# EAGLE design Full Water Level Detector Project Schematic (EAGLE 7.4.0)
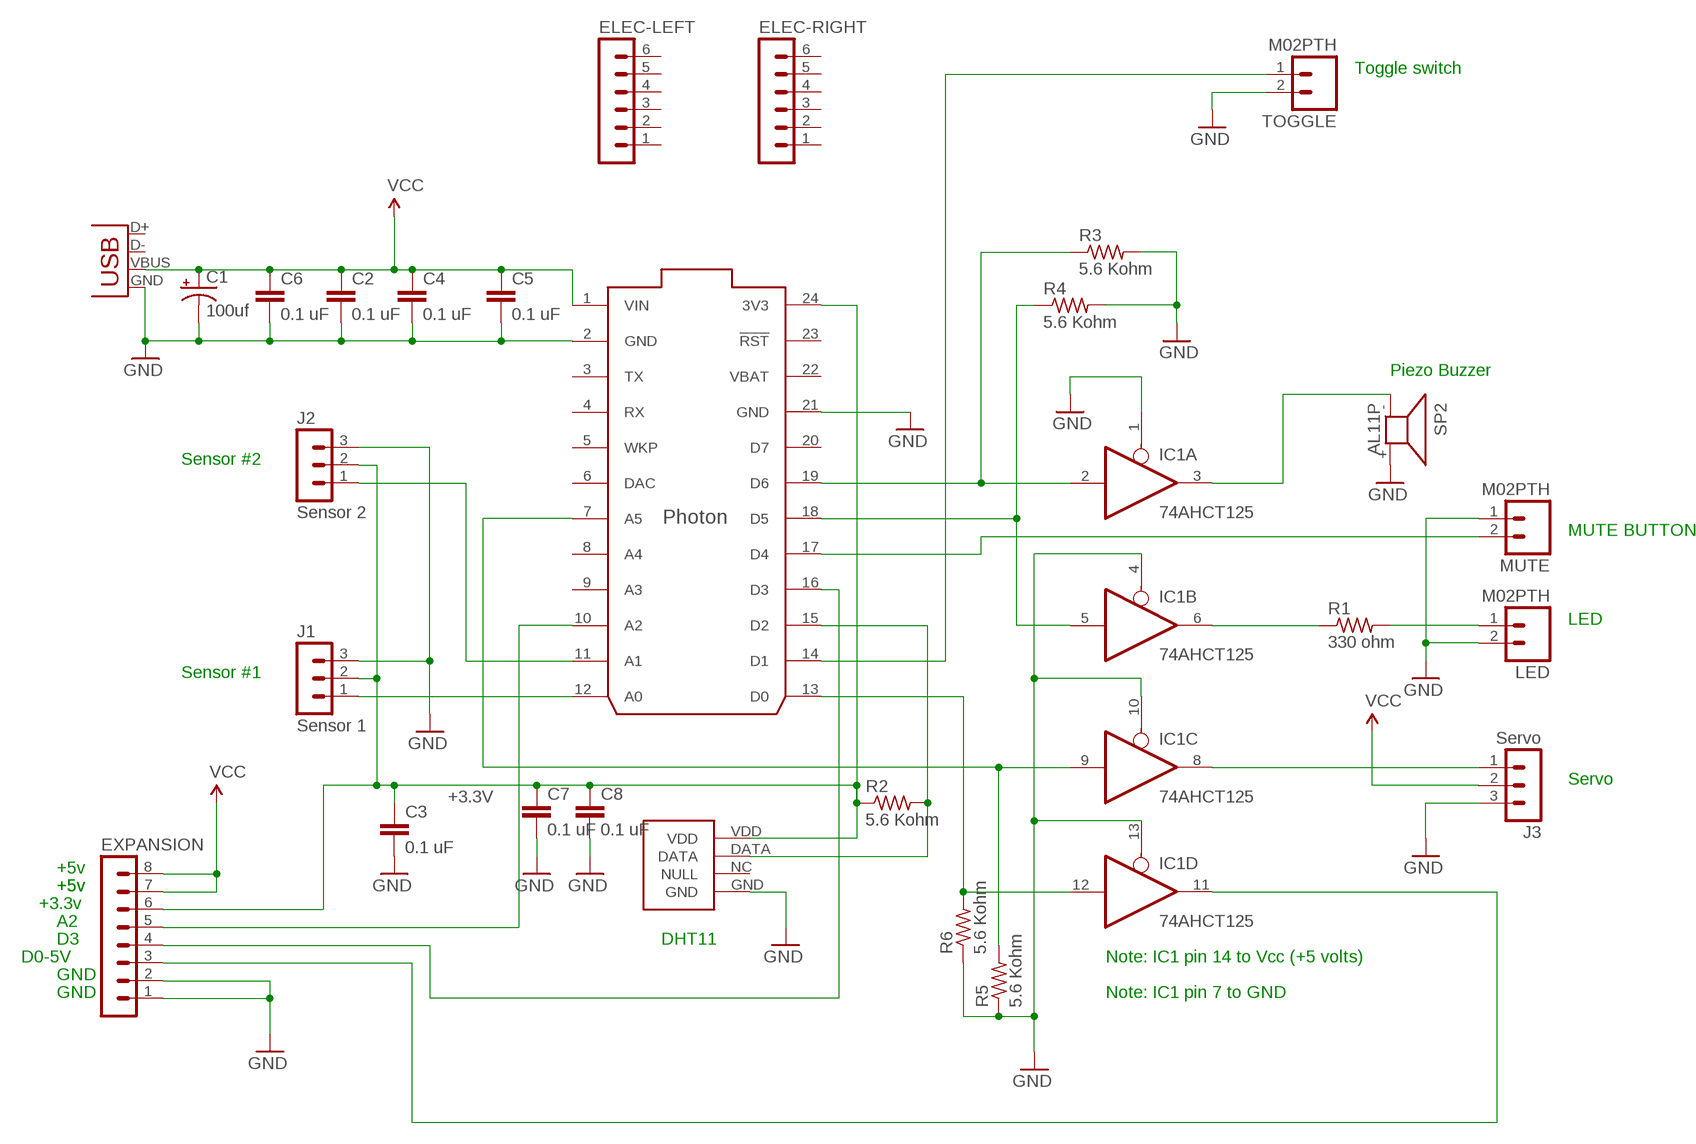
[diagram p0: schematic, sheet 1]

## Parts
C1  100uf  CAP_POLPTH1  [CPOL-RADIAL-100UF-25V]
C2  0.1 uF  CAPPTH  [CAP-PTH-SMALL]
C3  0.1 uF  CAPPTH  [CAP-PTH-SMALL]
C4  0.1 uF  CAPPTH  [CAP-PTH-SMALL]
C5  0.1 uF  CAPPTH  [CAP-PTH-SMALL]
C6  0.1 uF  CAPPTH  [CAP-PTH-SMALL]
C7  0.1 uF  CAPPTH  [CAP-PTH-SMALL]
C8  0.1 uF  CAPPTH  [CAP-PTH-SMALL]
ELEC-LEFT  MA06-1  [MA06-1]
ELEC-RIGHT  MA06-1  [MA06-1]
EXPANSION  MA08-1  [MA08-1]
IC1  74AHCT125  74125N  [DIL14]
J1  Sensor 1  MA03-1  [MA03-1]
J2  Sensor 2  MA03-1  [MA03-1]
J3  Servo  MA03-1  [MA03-1]
JP1  USB-B  USBPTH  [USB-B-PTH]
LED  M02PTH  [1X02]
MUTE  M02PTH  [1X02]
R1  330 ohm  R-US_0309/12  [0309/12]
R2  5.6 Kohm  R-US_0309/12  [0309/12]
R3  5.6 Kohm  R-US_0309/12  [0309/12]
R4  5.6 Kohm  R-US_0309/12  [0309/12]
R5  5.6 Kohm  R-US_0309/12  [0309/12]
R6  5.6 Kohm  R-US_0309/12  [0309/12]
SP2  AL11P  [AL11P]
TOGGLE  M02PTH  [1X02]
U$1  PHOTON_SMD  [PHOTON_SMD]
U$2  DHT22  [DHT22]

## Nets
+3.3V: C3.1 C7.1 C8.1 EXPANSION.6 J1.2 J2.2 R2.1 U$1.24(3V3) U$2.VDD
GND: C1.2(-) C2.2 C3.2 C4.2 C5.2 C6.2 C7.2 C8.2 EXPANSION.1 EXPANSION.2 IC1.1(A:OE) IC1.4(B:OE) IC1.10(C:OE) IC1.13(D:OE) J1.3 J2.3 J3.3 JP1.GND LED.2 MUTE.1 R3.2 R4.2 R5.1 R6.1 SP2.+ TOGGLE.2 U$1.2(GND) U$1.21(GND) U$2.GND
N$1: IC1.8(C:O) J3.1
N$2: J2.1 U$1.11(A1)
N$3: J1.1 U$1.12(A0)
N$4: IC1.2(A:I) R3.1 U$1.19(D6)
N$6: IC1.3(A:O) SP2.-
N$7: IC1.9(C:I) R5.2 U$1.7(A5)
N$9: IC1.6(B:O) R1.1
N$10: LED.1 R1.2
N$11: MUTE.2 U$1.17(D4)
N$14: EXPANSION.4 U$1.16(D3)
N$15: EXPANSION.3 IC1.11(D:O)
N$16: EXPANSION.5 U$1.10(A2)
N$17: IC1.12(D:I) R6.2 U$1.13(D0)
N$19: R2.2 U$1.15(D2) U$2.DATA
N$22: TOGGLE.1 U$1.14(D1)
N$23: IC1.5(B:I) R4.1 U$1.18(D5)
VCC: C1.1(+) C2.1 C4.1 C5.1 C6.1 EXPANSION.7 EXPANSION.8 J3.2 JP1.VBUS U$1.1(VIN)
Unconnected: ELEC-LEFT.1 ELEC-LEFT.2 ELEC-LEFT.3 ELEC-LEFT.4 ELEC-LEFT.5 ELEC-LEFT.6 ELEC-RIGHT.1 ELEC-RIGHT.2 ELEC-RIGHT.3 ELEC-RIGHT.4 ELEC-RIGHT.5 ELEC-RIGHT.6 JP1.D+ JP1.D- U$1.3(TX) U$1.4(RX) U$1.5(WKP) U$1.6(DAC) U$1.8(A4) U$1.9(A3) U$1.20(D7) U$1.23(!RST) U$1.25(EN) U$1.26(!SETUP) U$1.27(RGB_RED) U$1.28(RGB_GREEN) U$1.29(RGB_BLUE) U$1.30(USB_D-) U$1.31(USB_D+) U$2.NC(NULL)

## Notes on the sheet
- Toggle switch
- Piezo Buzzer
- Sensor #2
- MUTE BUTTON
- LED
- Sensor #1
- Servo
- +5v
- +5v | +5v
- +3.3v
- A2
- D3 | DHT11
- D0-5V | Note: IC1 pin 14 to Vcc (+5 volts)
- GND
- GND | Note: IC1 pin 7 to GND

## Power pins joined to a net without a drawn wire
GND: IC1.7(P:GND)
VBAT: U$1.22(VBAT)
VCC: IC1.14(P:VCC)

## Library data of the parts
C1 = SparkFun-Capacitors:CAP_POL: Capacitor Polarized These are standard SMD and PTH capacitors. Normally 10uF, 47uF, and 100uF in electrolytic and tantalum varieties. Always verify the external diameter of the through hole cap, it varies with capacity, voltage, and manufacturer. The EIA devices should be standard.
C2-C8 = SparkFun-Passives:CAP: Capacitor Standard 0603 ceramic capacitor, and 0.1" leaded capacitor.
ELEC-LEFT ELEC-RIGHT = con-lstb:MA06-1: PIN HEADER; OC_FARNELL: unknown; OC_NEWARK: unknown
EXPANSION = con-lstb:MA08-1: PIN HEADER; OC_FARNELL: unknown; OC_NEWARK: unknown
IC1 = 74xx-us:74*125: Quad bus BUFFER, 3-state
J1-J3 = con-lstb:MA03-1: PIN HEADER; OC_FARNELL: unknown; OC_NEWARK: unknown
JP1 = SparkFun-Connectors:USB: USB Connectors USB-B-PTH is fully proven SKU : PRT-00139/CONN-08278 USB-miniB is fully proven SKU : PRT-00587 USB-A-PCB is untested. USB-A-H is throughly reviewed, but untested. Spark Fun Electronics SKU : PRT-00437 USB-B-SMT is throughly reviewed, but untested. Needs silkscreen touching up. USB-A-S has not been used/tested USB-MB-H has not been used/tested USB-MICROB has been used. CONN-09505; PROD_ID: CONN-08278
LED MUTE TOGGLE = SparkFun-Connectors:M02: Standard 2-pin 0.1" header. Use with - straight break away headers ( PRT-00116) - right angle break away headers (PRT-00553) - swiss pins (PRT-00743) - machine pins (PRT-00117) - female headers (PRT-00115) Molex polarized connector foot print use with: PRT-08233 with associated crimp pins and housings. 2.54_SCREWTERM for use with PRT-10571. 3.5mm Screw Terminal footprints for PRT-08084 5mm Screw Terminal footprints for use with PRT-08433
R1-R6 = rcl:R-US_: RESISTOR, American symbol
SP2 = buzzer:AL11P: SPEAKER Source: Buerklin; OC_FARNELL: unknown; OC_NEWARK: unknown
U$1 = Spark:PHOTON_SMD: Photon (without headers) - designed to be surface mounted with 7 extra exposed pads on the bottom of the board which include, 3 RGB LED outputs, /SETUP, EN (3.3V SMPS enable input), USB D+ and USB D-.
U$2 = Spark:DHT22

## Board
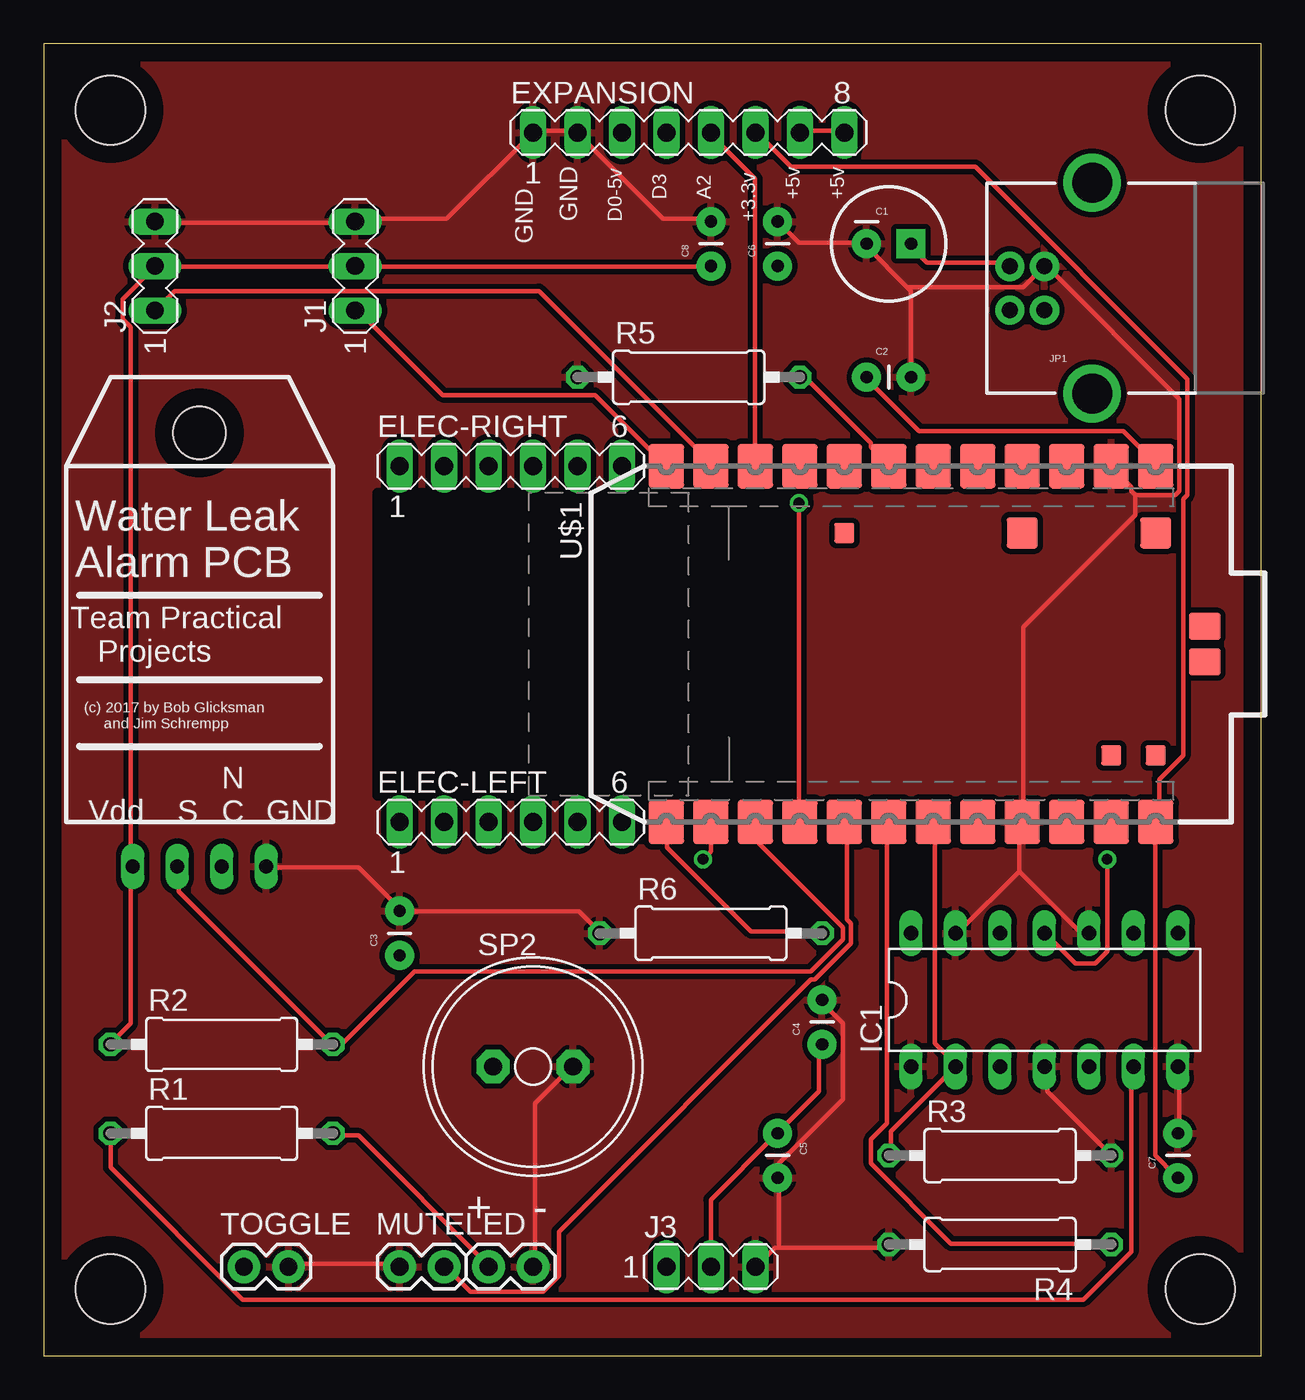
[diagram p1: board, top side]
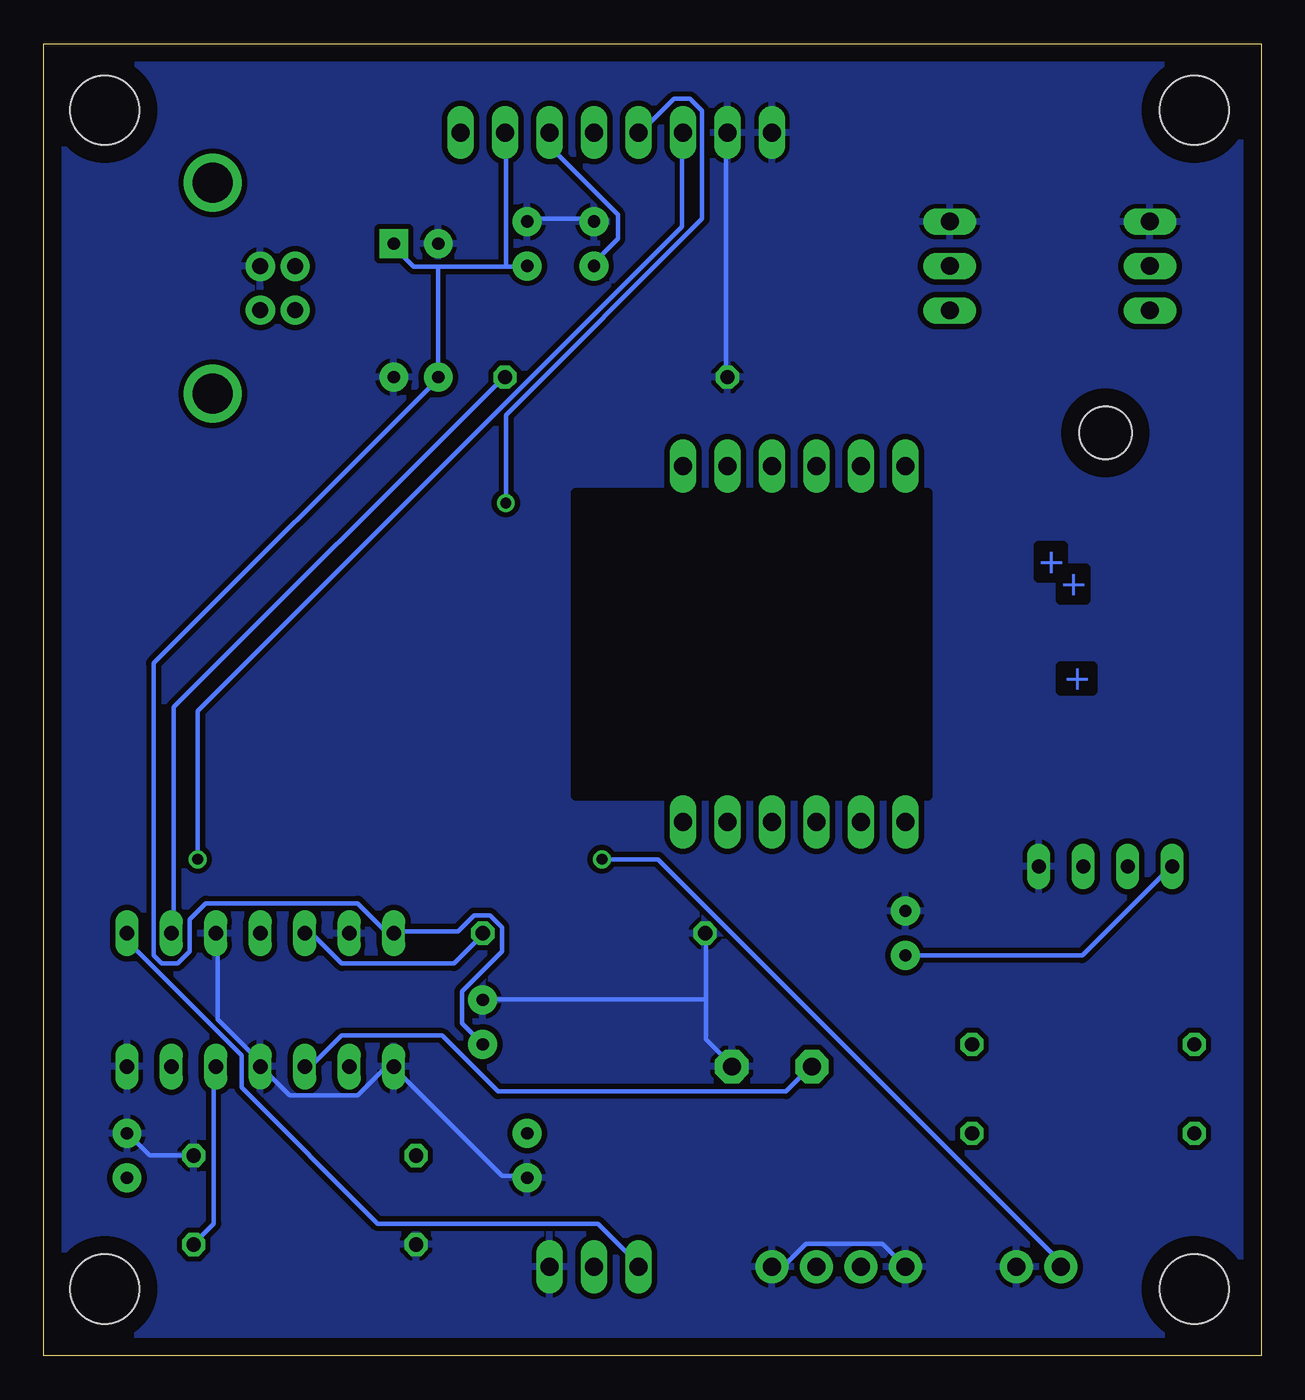
[diagram p2: board, bottom side, seen from below]

Size 69.52 x 74.92 mm. Coordinates in mm from the lower left corner, seen from the top.
Outline: 0,0 69.52,0 69.52,74.92 0,74.92 0,0
Copper layers (1*16): Top 0.035mm / dielectric 1.5mm / Bottom 0.035mm
Design rules "default": minimum track width 10mil, minimum drill 24mil, track to track 8mil, track to pad 8mil, pad to pad 8mil, via to via 8mil, smd to smd 8mil, copper to edge 40mil, drill to drill 8mil, minimum pad ring 10mil, minimum via ring 8mil, stop-mask expansion 4mil, vias tented up to drill 0mil, thermal gap 10mil
Holes 3.96 mm at 66.04,71.12 3.81,3.81 66.04,3.81 3.81,71.12
tKeepout: area 19.1,32.3 to 39.1,49.3
bKeepout: area 19.1,32 to 39.1,49.3
tRestrict: area 19.1,32 to 39.1,49.3
bRestrict: area 19.1,32 to 39.1,49.3

### Footprints (pad centres in the part's own frame; a part is rotated, then mirrored left to right if it is on the bottom)
CPOL-RADIAL-100UF-25V = drill 0.7 pad 1.651 square: 1 1.27,0 | drill 0.7 pad 1.651: 2 -1.27,0
CAP-PTH-SMALL = drill 0.7 pad 1.651: 1 0,0; 2 2.54,0
MA06-1 = drill 1.016 long: 1 -6.35,0; 2 -3.81,0; 3 -1.27,0; 4 1.27,0; 5 3.81,0; 6 6.35,0
MA08-1 = drill 1.016 long: 1 -8.89,0; 2 -6.35,0; 3 -3.81,0; 4 -1.27,0; 5 1.27,0; 6 3.81,0; 7 6.35,0; 8 8.89,0
DIL14 = drill 0.813 long: 1 -7.62,-3.81; 2 -5.08,-3.81; 3 -2.54,-3.81; 4 0,-3.81; 5 2.54,-3.81; 6 5.08,-3.81; 7 7.62,-3.81; 8 7.62,3.81; 9 5.08,3.81; 10 2.54,3.81; 11 0,3.81; 12 -2.54,3.81; 13 -5.08,3.81; 14 -7.62,3.81
MA03-1 = drill 1.016 long: 1 -2.54,0; 2 0,0; 3 2.54,0
USB-B-PTH = drill 0.914 pad 1.676: D+ 0,1.25; D- 1.981,1.25; GND 0,-1.25; VBUS 1.981,-1.25 | drill 2.286: S1 -2.718,-6.02; S2 -2.718,6.02
1X02 = drill 1.016 pad 1.88: 1 0,0; 2 2.54,0
0309/12 = drill 0.813 octagon: 1 -6.35,0; 2 6.35,0
AL11P = drill 1.016 pad 1.905 octagon: + 2.286,0; - -2.286,0
PHOTON_SMD = smd 2.54 x 2.032: 1 0,32.258; 2 0,29.718; 3 0,27.178; 4 0,24.638; 5 0,22.098; 6 0,19.558; 7 0,17.018; 8 0,14.478; 9 0,11.938; 10 0,9.398; 11 0,6.858; 12 0,4.318; 13 20.32,4.318; 14 20.32,6.858; 15 20.32,9.398; 16 20.32,11.938; 17 20.32,14.478; 18 20.32,17.018; 19 20.32,19.558; 20 20.32,22.098; 21 20.32,24.638; 22 20.32,27.178; 23 20.32,29.718; 24 20.32,32.258 | smd 1.778 x 1.778: 25 3.81,32.258; 26 3.81,24.638 | smd 1.143 x 1.143: 27 3.81,14.478; 28 16.51,29.718; 29 16.51,32.258 | smd 1.524 x 1.778: 30 11.176,35.052; 31 9.144,35.052
DHT22 = drill 0.8 long: DATA -1.27,0; GND 3.81,0; NC 1.27,0; VDD -3.81,0 | hole 3: 0,24.765

### Placement (x,y rotation side)
C1  48.26,63.5 0 top
C2  46.99,55.88 0 top
C3  20.32,22.86 90 top
C4  44.45,17.78 90 top
C5  41.91,12.7 270 top
C6  41.91,62.23 90 top
C7  64.77,10.16 90 top
C8  38.1,62.23 90 top
ELEC-LEFT  26.67,30.48 0 top
ELEC-RIGHT  26.67,50.8 0 top
EXPANSION  36.83,69.85 0 top
IC1  57.15,20.32 0 top
J1  17.78,62.23 90 top
J2  6.35,62.23 90 top
J3  38.1,5.08 0 top
JP1  57.15,60.96 180 top
LED  25.4,5.08 0 top
MUTE  20.32,5.08 0 top
R1  10.16,12.7 0 top
R2  10.16,17.78 0 top
R3  54.61,11.43 0 top
R4  54.61,6.35 180 top
R5  36.83,55.88 0 top
R6  38.1,24.13 0 top
SP2  27.94,16.51 0 top
TOGGLE  11.43,5.08 0 top
U$1  31.24,50.8 270 top
U$2  8.89,27.94 0 top

### Tracks (layer width: path | path; a pad name or v marks a point on that pad's centre or on a via)
+3.3V
  Top 0.254: R2.1 3.81,17.83 4.95,18.97 4.95,27.89 U$2.VDD 4.95,28.12 4.95,58.75 4.5,59.21 4.5,60.35 6.32,62.18 J2.2 6.55,62.18 17.75,62.18 J1.2 17.98,62.18 38.1,62.18 C8.1 | C7.1 64.62,10.29 63.47,11.43 63.47,30.4 U$1.24 63.7,30.63 63.7,32.92 65.08,34.29 65.08,48.92 65.3,49.15 65.3,55.78 53.19,67.89 42.67,67.89 40.84,69.72 EXPANSION.6
  Bottom 0.254: C3.1 10.21,22.86 5.18,27.89 U$2.VDD | EXPANSION.6 40.61,69.72 40.61,69.04 36.73,65.15 36.73,63.78 38.1,62.41 C8.1
GND
  Top 0.254: J2.3 6.55,64.69 17.75,64.69 J1.3 17.98,64.92 23.01,64.92 EXPANSION.1 28.04,69.95 30.33,69.95 EXPANSION.2 30.56,69.72 35.36,64.92 38.1,64.92 C8.2 | 62.33,49.15 62.1,49.38 62.1,49.61 60.96,50.75 U$1.2 | 62.33,49.15 64.62,49.15 64.85,49.38 64.85,54.63 57.3,62.18 JP1.GND 57.07,62.18 55.93,61.04 49.3,61.04 | C6.2 43.13,63.55 46.79,63.55 C1.2 47.02,63.32 49.3,61.04 | C2.2 49.53,60.81 49.3,61.04 | 55.7,27.66 55.7,30.4 U$1.21 55.93,30.63 55.93,41.6 62.33,48.01 62.33,49.15 | 55.7,27.66 52.27,24.23 IC1.13 | 55.7,27.66 59.13,24.23 59.59,24.23 IC1.10 | 41.99,6.17 41.76,6.17 40.84,5.26 J3.3 | 41.99,6.17 48.16,6.17 R4.2 | 41.99,6.17 41.99,10.06 C5.2 41.99,10.29 41.99,10.97 45.64,14.63 45.64,18.97 44.5,20.12 C4.2 | IC1.7 64.85,16.46 64.85,12.8 C7.2 | R3.2 57.3,15.09 57.3,16.46 IC1.4 | TOGGLE.2 14.1,5.26 20.27,5.26 MUTE.1 | U$2.GND 12.72,27.89 17.98,27.89 20.27,25.6 C3.2 20.5,25.38 30.56,25.38 31.7,24.23 R6.1 | LED.2 28.04,5.26 28.04,14.4 30.1,16.46 SP2.+
  Bottom 0.254: R5.1 30.56,56.01 30.56,69.72 EXPANSION.2 | C8.2 38.1,64.92 41.76,64.92 C6.2 | 49.53,16.46 49.99,16.46 51.59,14.86 55.47,14.86 57.07,16.46 IC1.4 57.07,16.69 59.59,19.2 59.59,24 IC1.10 | R3.2 63.47,11.43 64.62,12.57 C7.2 | 49.53,16.46 43.36,10.29 41.99,10.29 C5.2 | 49.53,16.46 IC1.1 | MUTE.1 21.64,6.4 25.98,6.4 27.13,5.26 27.81,5.26 LED.2 | 31.7,20.34 31.7,18.06 30.33,16.69 SP2.+ | 31.7,20.34 31.7,24 R6.1 | 31.7,20.34 44.27,20.34 C4.2
  pour Top (isolate 0.305): 0,74.93 69.85,74.93 69.85,0 0,0
  pour Bottom (isolate 0.305): 0,74.93 69.85,74.93 69.85,0 0,0
N$1
  Bottom 0.254: IC1.8 64.62,24 64.62,23.55 58.22,17.14 58.22,15.32 50.44,7.54 37.87,7.54 35.58,5.26 J3.1
N$2
  Top 0.254: J2.1 7.47,60.81 28.27,60.81 38.1,50.98 U$1.11
N$3
  Top 0.254: U$1.12 35.36,50.98 31.47,54.86 22.78,54.86 17.98,59.66 J1.1
N$4
  Top 0.254: U$1.19 50.9,30.4 50.9,17.83 52.05,16.69 IC1.2 52.05,16.46 48.39,12.8 48.39,11.43 R3.1
N$6
  Bottom 0.254: IC1.3 54.56,16.69 54.1,16.69 52.5,18.29 46.79,18.29 43.59,15.09 27.13,15.09 25.76,16.46 SP2.-
N$7
  Top 0.254: U$1.7 48.16,50.98 47.24,51.89 47.24,52.12 43.36,56.01 R5.2
  Bottom 0.254: IC1.9 62.1,24.23 62.1,37.03 43.36,55.78 R5.2
N$9
  Top 0.254: R1.1 3.81,10.74 11.35,3.2 59.36,3.2 62.1,5.94 62.1,16.46 IC1.6
N$10
  Top 0.254: R1.2 16.61,12.57 17.98,12.57 25.3,5.26 LED.1
N$11
  Top 0.254: U$1.17 45.87,30.4 45.87,24.92 46.1,24.69 46.1,23.55 44.04,21.49 43.81,21.49 29.41,7.09 29.41,4.57 28.5,3.66 24.38,3.66 23.01,5.03 MUTE.2
N$14  (via drill 0.61)
  Top 0.254: v43.13,48.69 43.13,30.63 U$1.16
  Bottom 0.254: v43.13,48.69 43.13,53.72 31.93,64.92 31.93,71.09 32.61,71.78 33.53,71.78 35.36,69.95 EXPANSION.4
N$15  (via drill 0.61)
  Top 0.254: v60.73,28.35 60.73,23.09 60.05,22.4 58.9,22.4 57.3,24 IC1.11
  Bottom 0.254: v60.73,28.35 60.73,36.8 33.07,64.47 33.07,69.72 EXPANSION.3
N$16
  Top 0.254: U$1.10 40.61,50.98 40.61,67.21 38.1,69.72 EXPANSION.5
N$17
  Top 0.254: U$1.13 35.58,30.4 35.58,29.03 40.39,24.23 44.27,24.23 R6.2
  Bottom 0.254: IC1.12 54.56,24 54.1,24 52.5,22.4 46.1,22.4 44.5,24 R6.2
N$19
  Top 0.254: U$1.15 40.84,30.4 40.84,29.26 45.64,24.46 45.64,23.77 43.81,21.95 21.18,21.95 17.07,17.83 16.61,17.83 R2.2 16.38,17.83 7.7,26.52 7.7,27.89 U$2.DATA
N$22  (via drill 0.61)
  Top 0.254: U$1.14 38.1,28.8 v37.64,28.35
  Bottom 0.254: v37.64,28.35 34.44,28.35 11.35,5.26 TOGGLE.1
N$23
  Top 0.254: U$1.18 48.16,30.4 48.16,13.26 47.24,12.34 47.24,10.97 51.82,6.4 60.96,6.4 R4.1
  Bottom 0.254: IC1.5 59.82,16.46 59.82,7.54 60.96,6.4 R4.1
VCC
  Top 0.254: J3.2 38.1,8.91 41.76,12.57 C5.1 41.99,12.8 44.27,15.09 44.27,17.6 C4.1 | U$1.1 63.47,50.98 61.65,52.81 49.99,52.81 47.02,55.78 C2.1 | EXPANSION.7 43.36,69.95 45.64,69.95 EXPANSION.8 | JP1.VBUS 55.02,62.41 50.44,62.41 49.53,63.32 C1.1
  Bottom 0.254: 49.53,24.23 45.87,24.23 44.96,25.15 44.04,25.15 43.36,24.46 43.36,23.09 45.64,20.8 45.64,18.97 C4.1 | 47.02,62.18 48.39,62.18 49.53,63.32 C1.1 | 47.02,62.18 43.13,62.18 | 43.13,62.18 41.99,62.18 C6.1 | 43.13,62.18 43.13,69.72 EXPANSION.7 | 47.02,62.18 47.02,56.01 C2.1 47.02,55.78 63.25,39.55 63.25,22.86 62.79,22.4 61.87,22.4 61.19,23.09 61.19,24.92 60.27,25.83 51.59,25.83 49.99,24.23 49.53,24.23 | 49.53,24.23 IC1.14

### Text on the board
Bottom: + | + | + | +
tPlace: D3 | A2 | +5v | +5v | GND | D0-5v | +3.3v | GND | Water Leak / Alarm PCB | Team Practical / Projects | (c) 2017 by Bob Glicksman / and Jim Schrempp | Vdd | S | N / C | GND | + | -